# Altium schematic sheet MainRevA.SchDoc
size A2; SheetNumber: 1; SheetTotal: 1
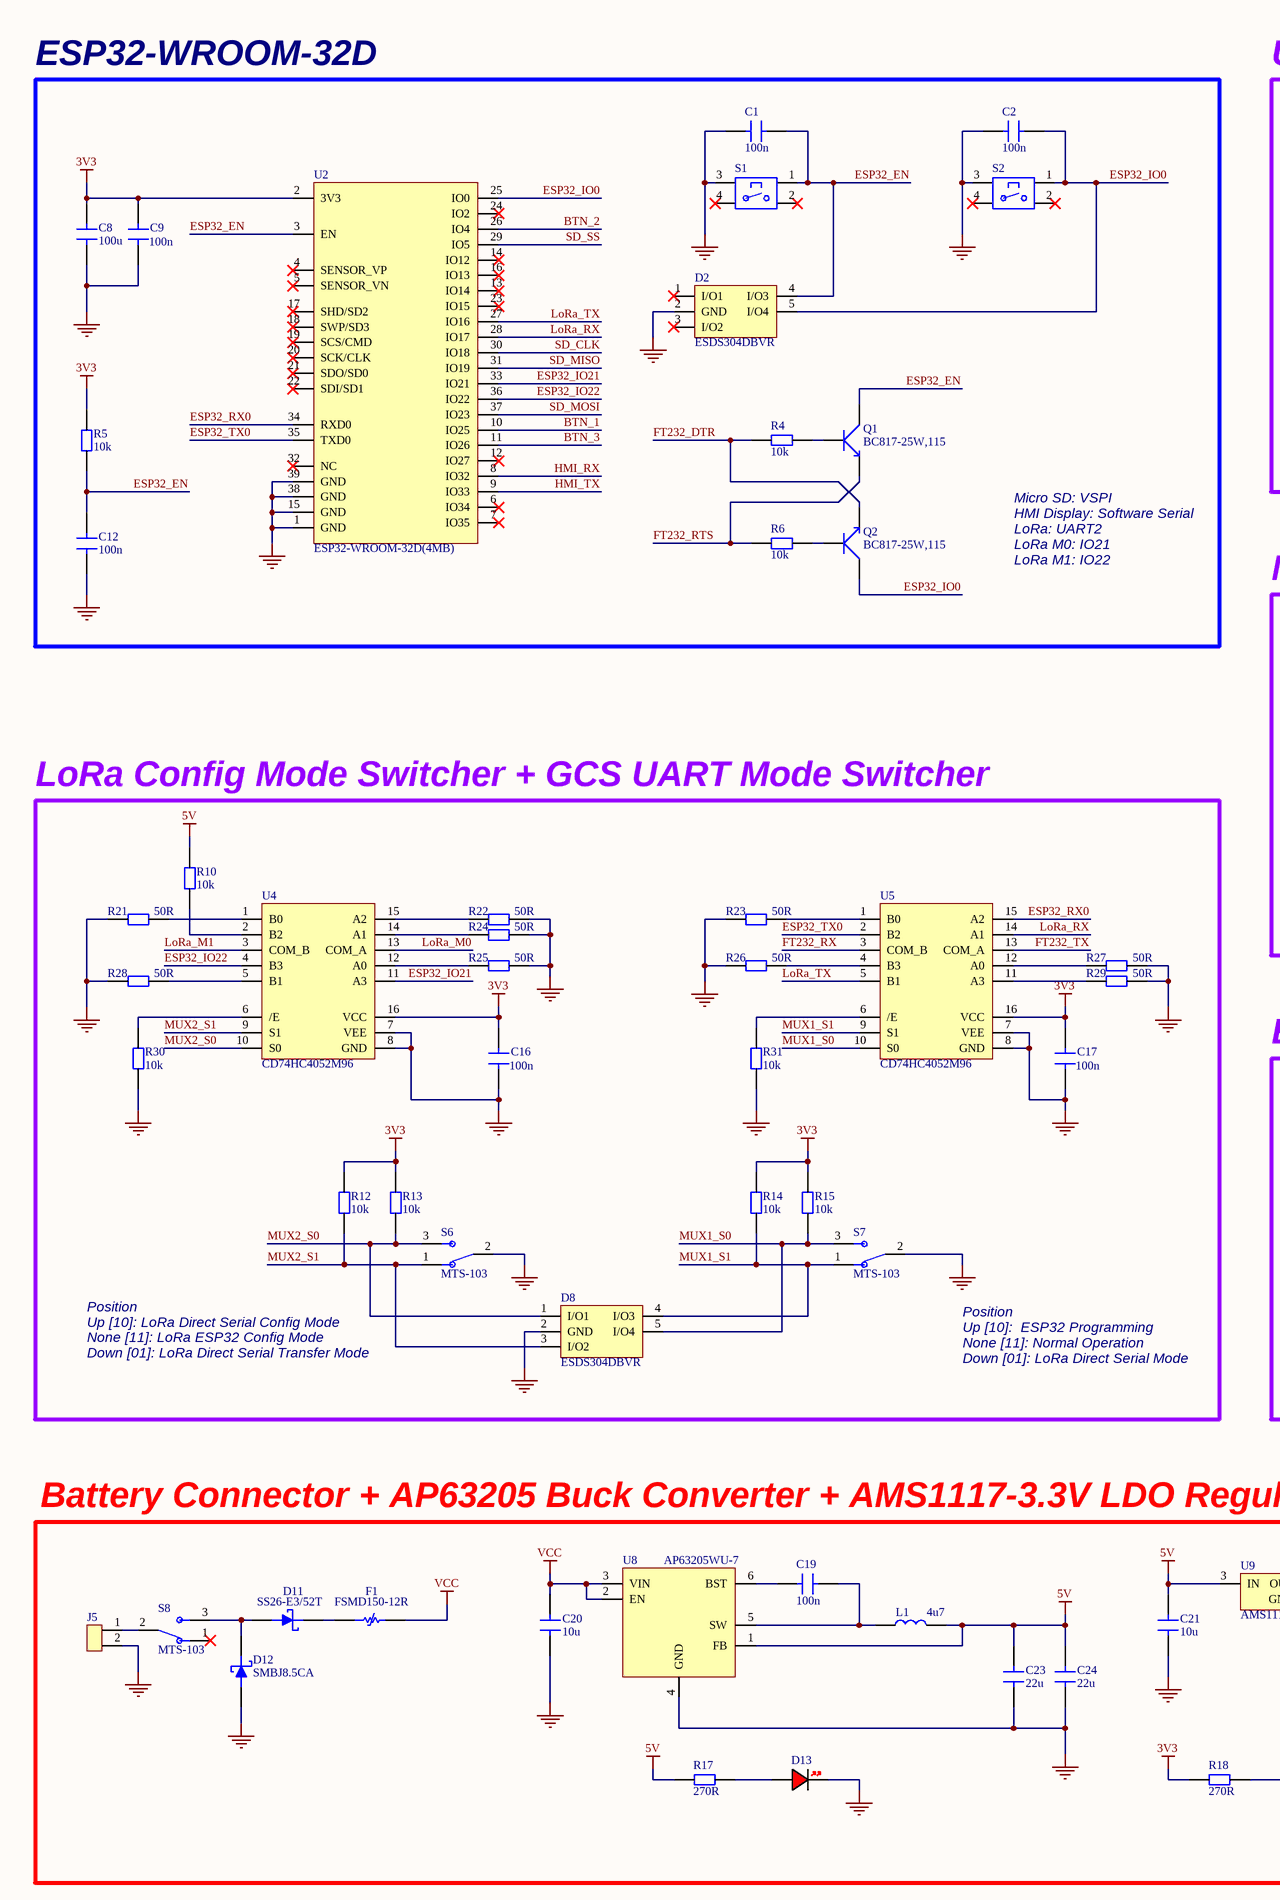
[diagram p0: MainRevA.SchDoc, left]
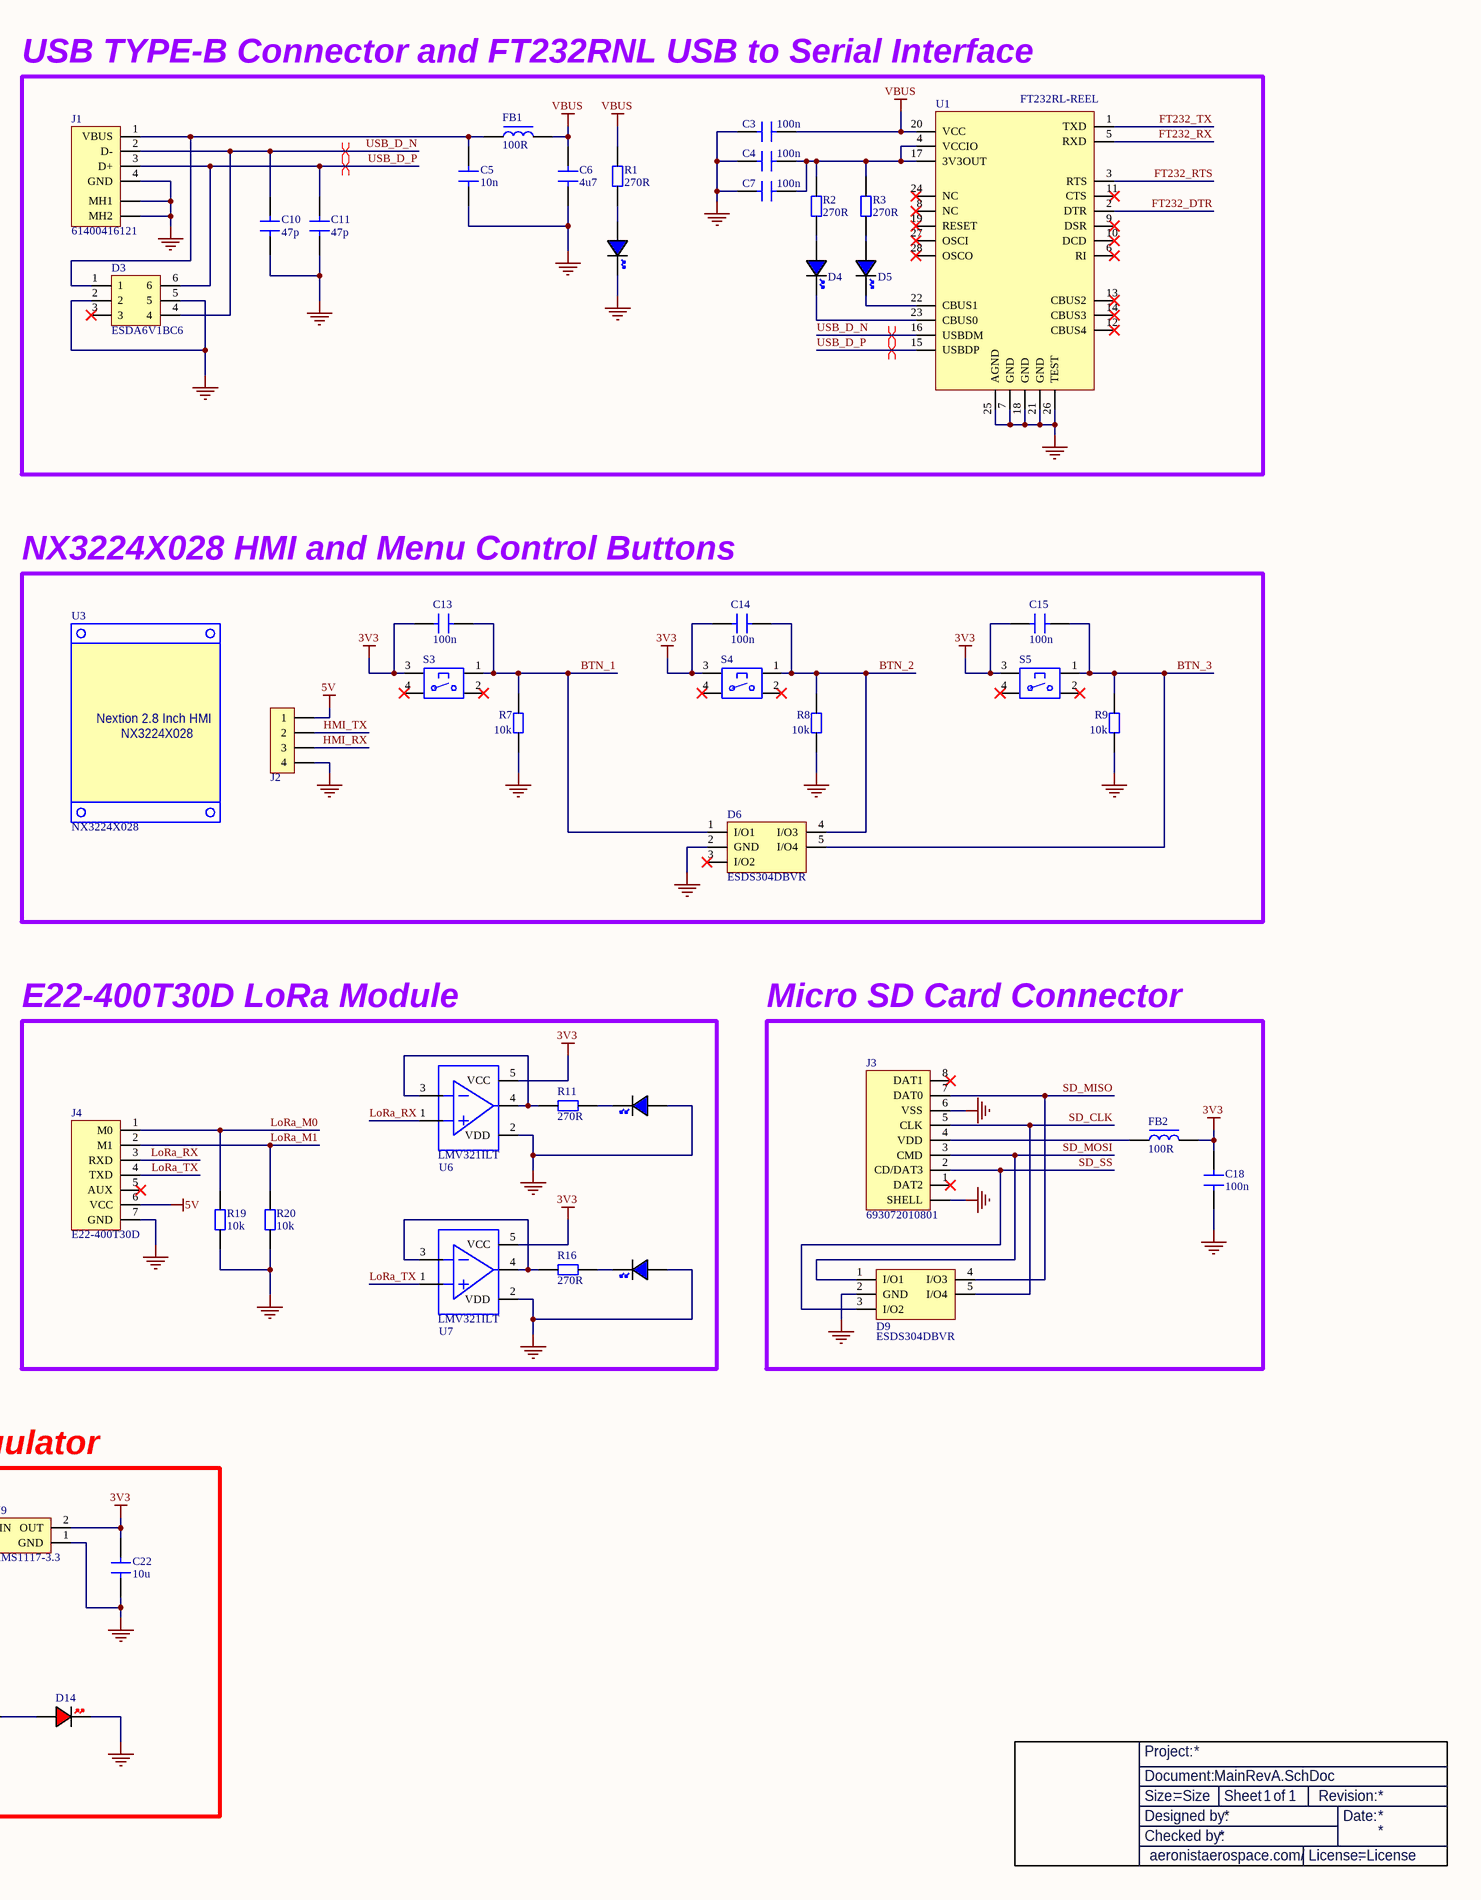
[diagram p1: MainRevA.SchDoc, right]

## Parts
?  Title Block  (value not drawn)  (graphical)
C1  100n  [CAP 0805]
C2  100n  [CAP 0805]
C3  100n  [CAP 0805]
C4  100n  [CAP 0805]
C5  10n  [CAP 0805]
C6  4u7  [CAP 0805]
C7  100n  [CAP 0805]
C8  100u  [CAP 1210]
C9  100n  [CAP 0805]
C10  47p  [CAP 0805]
C11  47p  [CAP 0805]
C12  100n  [CAP 0805]
C13  100n  [CAP 0805]
C14  100n  [CAP 0805]
C15  100n  [CAP 0805]
C16  100n  [CAP 0805]
C17  100n  [CAP 0805]
C18  100n  [CAP 0805]
C19  100n  [CAP 0805]
C20  10u  [CAP 1210]
C21  10u  [CAP 0805]
C22  10u  [CAP 0805]
C23  22u  [CAP 1210]
C24  22u  [CAP 1210]
D1  LED 0805 BLUE  [LED 0805 BLUE]  (value not drawn)
D2  ESDS304DBVR  [SOT-23-5]
D3  ESDA6V1BC6  [SOT-23-6]
D4  LED 0805 BLUE  [LED 0805 BLUE]  (value not drawn)
D5  LED 0805 BLUE  [LED 0805 BLUE]  (value not drawn)
D6  ESDS304DBVR  [SOT-23-5]
D7  LED 0805 BLUE  [LED 0805 BLUE]  (value not drawn)
D8  ESDS304DBVR  [SOT-23-5]
D9  ESDS304DBVR  [SOT-23-5]
D10  LED 0805 BLUE  [LED 0805 BLUE]  (value not drawn)
D11  SS26-E3/52T  [DO-214AA]
D12  SMBJ8.5CA  [SMBJ12CA-13-F]
D13  LED 0805 RED  [LED 0805 RED]  (value not drawn)
D14  LED 0805 RED  [LED 0805 RED]  (value not drawn)
F1  FSMD150-12R  [0ZCG0075FF2C]
FB1  100R  [FB 0805]
FB2  100R  [FB 0805]
J1  61400416121  [61400416121]
J2  1x4 HEADER MALE  [1X4 HEADER MALE]  (value not drawn)
J3  693072010801  [693072010801]
J4  E22-400T30D  [LoRa E22-433T30D H]
J5  KF350 2P Terminal  [KF350 2P]  (value not drawn)
L1  4u7  [IHLP2020CZER4R7M11]
Q1  BC817-25W,115  [BC817-25]
Q2  BC817-25W,115  [BC817-25]
R1  270R  [RES 0805]
R2  270R  [RES 0805]
R3  270R  [RES 0805]
R4  10k  [RES 0805]
R5  10k  [RES 0805]
R6  10k  [RES 0805]
R7  10k  [RES 0805]
R8  10k  [RES 0805]
R9  10k  [RES 0805]
R10  10k  [RES 0805]
R11  270R  [RES 0805]
R12  10k  [RES 0805]
R13  10k  [RES 0805]
R14  10k  [RES 0805]
R15  10k  [RES 0805]
R16  270R  [RES 0805]
R17  270R  [RES 0805]
R18  270R  [RES 0805]
R19  10k  [RES 0805]
R20  10k  [RES 0805]
R21  50R  [RES 0805]
R22  50R  [RES 0805]
R23  50R  [RES 0805]
R24  50R  [RES 0805]
R25  50R  [RES 0805]
R26  50R  [RES 0805]
R27  50R  [RES 0805]
R28  50R  [RES 0805]
R29  50R  [RES 0805]
R30  10k  [RES 0805]
R31  10k  [RES 0805]
S1  FSM4JSMATR  [FSM4JSMATR]  (value not drawn)
S2  FSM4JSMATR  [FSM4JSMATR]  (value not drawn)
S3  FSM4JSMATR  [FSM4JSMATR]  (value not drawn)
S4  FSM4JSMATR  [FSM4JSMATR]  (value not drawn)
S5  FSM4JSMATR  [FSM4JSMATR]  (value not drawn)
S6  MTS-103  [MTS-103]
S7  MTS-103  [MTS-103]
S8  MTS-103  [MTS-103]
U1  FT232RL-REEL  [FT232RL]
U2  ESP32-WROOM-32D(4MB)  [ESP32-WROOM-32]
U3  NX3224X028  [NX32224X028]
U4  CD74HC4052M96  [SOIC-16]
U5  CD74HC4052M96  [SOIC-16]
U6  LMV321ILT  [SOT-23-5]
U7  LMV321ILT  [SOT-23-5]
U8  AP63205WU-7  [AP63205]
U9  AMS1117-3.3  [SOT-223]

## Blocks framed on the sheet
ESP32-WROOM-32D: C1 C2 C8 C9 C12 D2 Q1 Q2 R4-R6 S1 S2 U2
USB TYPE-B Connector and FT232RNL USB to Serial Interface: C3-C7 C10 C11 D1 D3-D5 FB1 J1 R1-R3 U1
NX3224X028 HMI and Menu Control Buttons: C13-C15 D6 J2 R7-R9 S3-S5
LoRa Config Mode Switcher + GCS UART Mode Switcher: C16 C17 D8 R10 R12-R15 R21-R31 S6 S7 U4 U5
E22-400T30D LoRa Module: D7 D10 J4 R11 R16 R19 R20 U6 U7
Micro SD Card Connector: C18 D9 FB2 J3

## Nets
3V3: C8.2 C9.2 C13.2 C14.1 C15.2 C16.2 C17.2 C18.1 C22.1 FB2.2 R5.2 R12.2 R13.2 R14.2 R15.2 R18.1 S3.3 S4.3 S5.3 U2.2(3V3) U4.16(VCC) U5.16(VCC) U6.5(VCC) U7.5(VCC) U9.2(OUT)
5V: C21.1 C23.2 C24.2 J2.1 J4.6(VCC) L1.2 R10.2 R17.1 U8.1(FB) U9.3(IN)
GND: C1.2 C2.2 C3.2 C4.2 C5.1 C6.1 C7.2 C8.1 C9.1 C10.1 C11.1 C12.2 C16.1 C17.1 C18.2 C20.1 C21.2 C22.2 C23.1 C24.1 D1.K D2.2(GND) D3.2 D3.5 D6.2(GND) D7.A D8.2(GND) D9.2(GND) D10.A D12.1 D13.K D14.K J1.4(GND) J1.MH1 J1.MH2 J2.4 J3.6(VSS) J3.SHELL J4.7(GND) J5.2 R7.2 R8.2 R9.2 R19.1 R20.1 R21.2 R22.1 R23.2 R24.1 R25.1 R26.2 R27.1 R28.2 R29.1 R30.1 R31.1 S1.3 S2.3 S6.2 S7.2 U1.7(GND) U1.18(GND) U1.21(GND) U1.25(AGND) U1.26(TEST) U2.1(GND) U2.15(GND) U2.38(GND) U2.39(GND) U4.7(VEE) U4.8(GND) U5.7(VEE) U5.8(GND) U6.2(VDD) U7.2(VDD) U8.4(GND) U9.1(GND)
VBUS: C3.1 C6.2 FB1.2 R1.1 U1.20(VCC)
VCC: C20.2 F1.2 U8.2(EN) U8.3(VIN)
BTN_1: C13.1 D6.1(I/O1) R7.1 S3.1 U2.10(IO25)
BTN_2: C14.2 D6.4(I/O3) R8.1 S4.1 U2.26(IO4)
BTN_3: C15.1 D6.5(I/O4) R9.1 S5.1 U2.11(IO26)
ESP32_EN: C1.1 C12.1 D2.4(I/O3) Q1.3(C) R5.1 S1.1 U2.3(EN)
ESP32_IO0: C2.1 D2.5(I/O4) Q2.3(C) S2.1 U2.25(IO0)
ESP32_IO21: U2.33(IO21) U4.11(A3)
ESP32_IO22: U2.36(IO22) U4.4(B3)
ESP32_RX0: U2.34(RXD0) U5.15(A2)
ESP32_TX0: U2.35(TXD0) U5.2(B2)
FT232_DTR: Q2.2(E) R4.2 U1.2(DTR)
FT232_RTS: Q1.2(E) R6.2 U1.3(RTS)
FT232_RX: U1.5(RXD) U5.3(COM_B)
FT232_TX: U1.1(TXD) U5.13(COM_A)
HMI_RX: J2.3 U2.8(IO32)
HMI_TX: J2.2 U2.9(IO33)
LoRa_M0: J4.1(M0) R19.2 U4.13(COM_A)
LoRa_M1: J4.2(M1) R20.2 U4.3(COM_B)
LoRa_RX: J4.3(RXD) U2.28(IO17) U5.14(A1) U6.1(+)
LoRa_TX: J4.4(TXD) U2.27(IO16) U5.5(B1) U7.1(+)
MUX1_S0: D8.5(I/O4) R15.1 S7.3 U5.10(S0)
MUX1_S1: D8.4(I/O3) R14.1 S7.1 U5.9(S1)
MUX2_S0: D8.1(I/O1) R13.1 S6.3 U4.10(S0)
MUX2_S1: D8.3(I/O2) R12.1 S6.1 U4.9(S1)
SD_CLK: D9.5(I/O4) J3.5(CLK) U2.30(IO18)
SD_MISO: D9.4(I/O3) J3.7(DAT0) U2.31(IO19)
SD_MOSI: D9.1(I/O1) J3.3(CMD) U2.37(IO23)
SD_SS: D9.3(I/O2) J3.2(CD/DAT3) U2.29(IO5)
USB_D_N: C10.2 D3.4 J1.2(D-) U1.16(USBDM)
USB_D_P: C11.2 D3.6 J1.3(D+) U1.15(USBDP)
NetC4_1: C4.1 C7.1 R2.1 R3.1 U1.4(VCCIO) U1.17(3V3OUT)
NetC5_2: C5.2 D3.1 FB1.1 J1.1(VBUS)
NetC19_1: C19.1 L1.1 U8.5(SW)
NetC19_2: C19.2 U8.6(BST)
NetD1_A: D1.A R1.2
NetD4_A: D4.A R2.2
NetD4_K: D4.K U1.23(CBUS0)
NetD5_A: D5.A R3.2
NetD5_K: D5.K U1.22(CBUS1)
NetD7_K: D7.K R11.2
NetD10_K: D10.K R16.2
NetD11_1: D11.1 F1.1
NetD11_2: D11.2 D12.2 S8.3
NetD13_A: D13.A R17.2
NetD14_A: D14.A R18.2
NetFB2_1: FB2.1 J3.4(VDD)
NetJ5_1: J5.1 S8.2
NetQ1_1: Q1.1(B) R4.1
NetQ2_1: Q2.1(B) R6.1
NetR10_1: R10.1 U4.2(B2)
NetR11_1: R11.1 U6.3(-) U6.4(OUT)
NetR16_1: R16.1 U7.3(-) U7.4(OUT)
NetR21_1: R21.1 U4.1(B0)
NetR22_2: R22.2 U4.15(A2)
NetR23_1: R23.1 U5.1(B0)
NetR24_2: R24.2 U4.14(A1)
NetR25_2: R25.2 U4.12(A0)
NetR26_1: R26.1 U5.4(B3)
NetR27_2: R27.2 U5.12(A0)
NetR28_1: R28.1 U4.5(B1)
NetR29_2: R29.2 U5.11(A3)
NetR30_2: R30.2 U4.6(/E)
NetR31_2: R31.2 U5.6(/E)

Not connected (* = marked no-connect by the designer): D2 1(I/O1)* 3(I/O2)*; D3 3*; D6 3(I/O2)*; J3 1(DAT2)* 8(DAT1)*; J4 5(AUX)*; S1 2* 4*; S2 2* 4*; S3 2* 4*; S4 2* 4*; S5 2* 4*; S8 1*; U1 6(RI)* 8(NC)* 9(DSR)* 10(DCD)* 11(CTS)* 12(CBUS4)* 13(CBUS2)* 14(CBUS3)* 19(RESET)* 24(NC)* 27(OSCI)* 28(OSCO)*; U2 4(SENSOR_VP)* 5(SENSOR_VN)* 6(IO34)* 7(IO35)* 12(IO27)* 13(IO14)* 14(IO12)* 16(IO13)* 17(SHD/SD2)* 18(SWP/SD3)* 19(SCS/CMD)* 20(SCK/CLK)* 21(SDO/SD0)* 22(SDI/SD1)* 23(IO15)* 24(IO2)* 32(NC)*

## Layout directives
differential pair; differential pair class DIFF_USB: USB_D_N, USB_D_P

## Notes on the sheet
- Micro SD: VSPI
- HMI Display: Software Serial
- LoRa: UART2
- LoRa M0: IO21
- LoRa M1: IO22
- Position
- Up [10]: LoRa Direct Serial Config Mode
- None [11]: LoRa ESP32 Config Mode
- Down [01]: LoRa Direct Serial Transfer Mode
- Up [10]:  ESP32 Programming
- None [11]: Normal Operation
- Down [01]: LoRa Direct Serial Mode
- Battery Connector + AP63205 Buck Converter + AMS1117-3.3V LDO Regulator
- (in symbol NX3224X028) Nextion 2.8 Inch HMI
- (in symbol Title Block) Project:; Document:; Size:; Sheet; of; Revision:; Designed by:; Date:; Checked by:; aeronistaerospace.com/; License:

## Library data of the parts
C1-C7 C9-C19 C21 C22 = CAP 0805 50V: Capacitor SMD 0805 50V
C8 C23 C24 = CAP 1210 25V: Capacitor SMD 1210 25V
C20 = CAP 1210 50V: Capacitor SMD 1210 50V
D1 D4 D5 D7 D10 = LED 0805 BLUE: LED 0805 GREEN SMD
D2 D6 D8 D9 = ESDS304DBVR: Trans Voltage Suppressor Diode, 85W, 3.6V V(RWM), Unidirectional, 4 Element, Silicon; Manufacturer: Texas Instruments; Supplier: Mouser; Supplier Part Number: 595-ESDS304DBVR; Manufacturer Part Number: ESDS304DBVR; RoHS: Yes; Category: TVS Diodes; Stock: 132; Pricing: 1=0,45, 10=0,304, 50=0,304, 100=0,282, 1000=0,202, 10000=0,15 (USD); Terminal Finish: Tin; JESD-609 Code: e3; Diode Type: TRANS VOLTAGE SUPPRESSOR; Moisture Sensitivity Level: 1; Reach SVHC Compliant: Yes; RoHS Compliant: Yes; ComponentLink1URL: https://www.ti.com:443/lit/ds/symlink/esds302.pdf?src-supplier=IHS+Markit; ComponentLink1Description: https://www.ti.com:443/lit/ds/symlink/esds302.pdf?src-supplier=IHS+Markit; ComponentLink2URL: http://www.ti.com/lit/ds/symlink/esds302.pdf?src-supplier=Digikey; ComponentLink2Description: http://www.ti.com/lit/ds/symlink/esds302.pdf?src-supplier=Digikey
D3 = ESDA6V1BC6: Trans Voltage Suppressor Diode, 80W, 5V V(RWM), Bidirectional, 4 Element, Silicon; Manufacturer: STMicroelectronics; Package Body Material: Plastic; Max Breakdown Voltage: 8V; Min Breakdown Voltage: 6.1V; Number of Elements: 4; Time @ Peak Reflow Temperature-Max (s): 30s; Qualification Status: Not Qualified; Supplier: Arrow Electronics; Supplier Part Number: ESDA6V1BC6; Manufacturer Part Number: ESDA6V1BC6; RoHS: Yes; Category: TVS Diodes; Stock: 84000; Pricing: 3000=0,1532 (USD); Pins: 6; Diode Element Material: SILICON; Package Shape: Rectangular; Terminal Finish: Nickel; Max Operating Temperature: 150°C; JESD-609 Code: e4; Polarity: Bidirectional; Diode Type: TRANS VOLTAGE SUPPRESSOR; JESD-30 Code: R-PDSO-G6; Moisture Sensitivity Level: 1; Non-rep Peak Rev Power Dis-Max: 80W; Package Style: SMALL OUTLINEMeter; Peak Reflow Temperature (Cel): 260°C; Rep Pk Reverse Voltage-Max: 5V; Surface Mount: Yes; Technology: AVALANCHE; Terminal Form: Gull Wing; Terminal Position: DUAL; Reach SVHC Compliant: Yes; RoHS Compliant: Yes; ComponentLink1URL: https://datasheet.ciiva.com:443/pdfs/VipMasterIC/IC/SGST/SGSTS47549/SGSTS47549-1.pdf?src-supplier=IHS+Markit; ComponentLink1Description: https://datasheet.ciiva.com:443/pdfs/VipMasterIC/IC/SGST/SGSTS47549/SGSTS47549-1.pdf?src-supplier=IHS+Markit; ComponentLink2URL: https://datasheet.ciiva.com/14186/esda6v1bc6-st-eng-tds-14186554.pdf?src-supplier=Distrelec; ComponentLink2Description: https://datasheet.ciiva.com/14186/esda6v1bc6-st-eng-tds-14186554.pdf?src-supplier=Distrelec; ComponentLink3URL: https://datasheet.ciiva.com/4507/cd00001906-94538-4507893.pdf?src-supplier=Mouser; ComponentLink3Description: https://datasheet.ciiva.com/4507/cd00001906-94538-4507893.pdf?src-supplier=Mouser; ComponentLink4URL: https://datasheet.ciiva.com/15143/getdatasheetpartid-148472-15143793.pdf?src-supplier=Verical; ComponentLink4Description: https://datasheet.ciiva.com/15143/getdatasheetpartid-148472-15143793.pdf?src-supplier=Verical; ComponentLink5URL: https://datasheet.ciiva.com/7662/1671767-7662124.pdf?src-supplier=Element14; ComponentLink5Description: https://datasheet.ciiva.com/7662/1671767-7662124.pdf?src-supplier=Element14; ComponentLink6URL: https://datasheet.ciiva.com/338/cd00001906-338704.pdf?src-supplier=Digikey; ComponentLink6Description: https://datasheet.ciiva.com/338/cd00001906-338704.pdf?src-supplier=Digikey; ComponentLink7URL: https://datasheet.ciiva.com/338/cd00001906-338705.pdf?src-supplier=Digikey; ComponentLink7Description: https://datasheet.ciiva.com/338/cd00001906-338705.pdf?src-supplier=Digikey; ComponentLink8URL: https://datasheet.ciiva.com/11194/cd00001906-11194053.pdf?src-supplier=Avnet; ComponentLink8Description: https://datasheet.ciiva.com/11194/cd00001906-11194053.pdf?src-supplier=Avnet
D11 = SS26-E3/52T: Rectifier Diode, Schottky, 1 Phase, 1 Element, 2A, 60V V(RRM), Silicon, DO-214AA; Manufacturer: Vishay Semiconductors; Package Body Material: Plastic; Application(s): EFFICIENCY; Forward Voltage: 700mV; Non-rep Pk Forward Current-Max: 75A; Number of Elements: 1; Qualification Status: Not Qualified; Supplier: Arrow Electronics; Supplier Part Number: SS26-E3/52T; Manufacturer Part Number: SS26-E3/52T; RoHS: Yes; Category: Rectifier Diodes; Stock: 1482000; Pricing: 750=0,1023 (USD); Pins: 2; Diode Element Material: SILICON; Package Shape: Rectangular; Terminal Finish: Tin; Min Operating Temperature: -65°C; Max Operating Temperature: 150°C; JESD-609 Code: e3; Diode Type: RECTIFIER; JESD-30 Code: R-PDSO-C2; Moisture Sensitivity Level: 1; Number of Phases: 1; Max Output current: 2A; Package Style: SMALL OUTLINEMeter; Peak Reflow Temperature (Cel): 260°C; Rep Pk Reverse Voltage-Max: 60V; Surface Mount: Yes; Technology: SCHOTTKY; Terminal Form: C BEND; Terminal Position: DUAL; JEDEC-95 Code: DO-214AA; RoHS Compliant: Yes; Reach SVHC Compliant: No; ComponentLink1URL: https://datasheet.ciiva.com:443/pdfs/VipMasterIC/IC/VISH/VISH-S-A0003397022/VISH-S-A0003397022-1.pdf?src-supplier=IHS+Markit; ComponentLink1Description: https://datasheet.ciiva.com:443/pdfs/VipMasterIC/IC/VISH/VISH-S-A0003397022/VISH-S-A0003397022-1.pdf?src-supplier=IHS+Markit; ComponentLink2URL: http://www.farnell.com/datasheets/2243773.pdf?src-supplier=Farnell; ComponentLink2Description: http://www.farnell.com/datasheets/2243773.pdf?src-supplier=Farnell; ComponentLink3URL: http://www.mouser.com/ds/2/427/ss22-59686.pdf?src-supplier=Mouser; ComponentLink3Description: http://www.mouser.com/ds/2/427/ss22-59686.pdf?src-supplier=Mouser; ComponentLink4URL: http://components.arrow.com/part/dataview/42820119S9715575N5680?src-supplier=Arrow+Electronics; ComponentLink4Description: http://components.arrow.com/part/dataview/42820119S9715575N5680?src-supplier=Arrow+Electronics; ComponentLink5URL: https://www.alliedelec.com/m/d/a5cdc6a9796d04f8094106d10cac2262.pdf?src-supplier=Allied+Electronics; ComponentLink5Description: https://www.alliedelec.com/m/d/a5cdc6a9796d04f8094106d10cac2262.pdf?src-supplier=Allied+Electronics; ComponentLink6URL: http://www.produktinfo.conrad.com/datenblaetter/575000-599999/596527-da-01-en-DIODE_SCHOTTKY_SS26_E3_52T_DO_214AA_VIS.pdf?src-supplier=Conrad; ComponentLink6Description: http://www.produktinfo.conrad.com/datenblaetter/575000-599999/596527-da-01-en-DIODE_SCHOTTKY_SS26_E3_52T_DO_214AA_VIS.pdf?src-supplier=Conrad; ComponentLink7URL: http://www.vishay.com/docs/88748/88748.pdf?src-supplier=Future+Electronics; ComponentLink7Description: http://www.vishay.com/docs/88748/88748.pdf?src-supplier=Future+Electronics; ComponentLink8URL: https://datasheet.octopart.com/SS26-E3-52T-Vishay-datasheet-11549126.pdf?src-supplier=Newark; ComponentLink8Description: https://datasheet.octopart.com/SS26-E3-52T-Vishay-datasheet-11549126.pdf?src-supplier=Newark; ComponentLink9URL: https://datasheet.octopart.com/SS26-E3-52T-Vishay-datasheet-78862754.pdf?src-supplier=Element14; ComponentLink9Description: https://datasheet.octopart.com/SS26-E3-52T-Vishay-datasheet-78862754.pdf?src-supplier=Element14; ComponentLink10URL: http://www.farnell.com/datasheets/2243773.pdf?src-supplier=Newark; ComponentLink10Description: http://www.farnell.com/datasheets/2243773.pdf?src-supplier=Newark; ComponentLink11URL: https://datasheet.octopart.com/SS26-E3/52T-Vishay-datasheet-126433.pdf?src-supplier=Digikey; ComponentLink11Description: https://datasheet.octopart.com/SS26-E3/52T-Vishay-datasheet-126433.pdf?src-supplier=Digikey; ComponentLink12URL: http://www.vishay.com/docs/88748/88748.pdf?src-supplier=Avnet; ComponentLink12Description: http://www.vishay.com/docs/88748/88748.pdf?src-supplier=Avnet; ComponentLink13URL: http://www.vishay.com/docs/88748/ss22.pdf?src-supplier=Digikey; ComponentLink13Description: http://www.vishay.com/docs/88748/ss22.pdf?src-supplier=Digikey; ComponentLink14URL: http://docs-usa.electrocomponents.com/techlib:/itc_doclist_US.htm?stockno=7000962&src-supplier=Allied+Electronics; ComponentLink14Description: http://docs-usa.electrocomponents.com/techlib:/itc_doclist_US.htm?stockno=7000962&src-supplier=Allied+Electronics; ComponentLink15URL: https://datasheet.octopart.com/SS26-E3-52T-Vishay-datasheet-42673615.pdf?src-supplier=TME; ComponentLink15Description: https://datasheet.octopart.com/SS26-E3-52T-Vishay-datasheet-42673615.pdf?src-supplier=TME
D12 = SMBJ8.5CA: Diode TVS Single Bi-Dir 8.5V 600W 2-Pin SMB; Manufacturer: Bourns; Number of Bidirectional Channels: 1; Min Breakdown Voltage: 9.44V; Clamping Voltage: 137V; Power Line Protection: No; Breakdown Voltage: 10.8V; Polarity: Bidirectional; Peak Pulse Current: 41.7A; Diode Type: ZENER; Reverse Breakdown Voltage: 94.4V; Operating Supply Voltage: 3.5V; Max Surge Current: 100A; Max Reverse Leakage Current: 40uA; Test Current: 1mA; Leakage Current: 1uA; Supplier 1: Avnet; Manufacturer Part Number: SMBJ8.5CA; RoHS: Yes; Category: TVS Diodes; Pricing 1: 12000=0,0994, 18000=0,0973, 30000=0,0952, 60000=0,0931, 120000=0,091, 600000=0,0889, 1200000=0,0875 (USD); Mount: Surface Mount; Case/Package: DO-214AA; Number of Pins: 2; Min Operating Temperature: -55°C; Max Operating Temperature: 150°C; Packaging: Tape and Reel; Reverse Standoff Voltage: 8.5V; Peak Pulse Power: 600W; Series: SMBJ; Direction: Bidirectional; Number of Channels: 1; Number of Elements: 1; Max Breakdown Voltage: 10.8V; Max Power Dissipation: 600W; Termination: SMD/SMT; Radiation Hardening: No; Reach SVHC Compliant: No; RoHS Compliant: Yes; ComponentLink1URL: https://datasheet.ciiva.com/4510/smbj-51809-4510857.pdf?src-supplier=Mouser; ComponentLink1Description: https://datasheet.ciiva.com/4510/smbj-51809-4510857.pdf?src-supplier=Mouser; ComponentLink2URL: https://datasheet.ciiva.com/3022/smbj-3022665.pdf?src-supplier=Avnet; ComponentLink2Description: https://datasheet.ciiva.com/3022/smbj-3022665.pdf?src-supplier=Avnet; ComponentLink3URL: https://datasheet.ciiva.com/3022/smbj-3022666.pdf?src-supplier=Avnet; ComponentLink3Description: https://datasheet.ciiva.com/3022/smbj-3022666.pdf?src-supplier=Avnet; ComponentLink4URL: https://datasheet.ciiva.com/334/smbj-334791.pdf?src-supplier=Digikey; ComponentLink4Description: https://datasheet.ciiva.com/334/smbj-334791.pdf?src-supplier=Digikey; ComponentLink5URL: https://datasheet.ciiva.com/334/smbj-334792.pdf?src-supplier=Digikey; ComponentLink5Description: https://datasheet.ciiva.com/334/smbj-334792.pdf?src-supplier=Digikey; ComponentLink6URL: https://datasheet.ciiva.com/334/smbj-334790.pdf?src-supplier=Digikey; ComponentLink6Description: https://datasheet.ciiva.com/334/smbj-334790.pdf?src-supplier=Digikey; ComponentLink7URL: https://datasheet.ciiva.com/3022/smbj-3022670.pdf?src-supplier=Avnet; ComponentLink7Description: https://datasheet.ciiva.com/3022/smbj-3022670.pdf?src-supplier=Avnet; ComponentLink8URL: https://datasheet.ciiva.com/334/smbj-334764.pdf?src-supplier=Digikey; ComponentLink8Description: https://datasheet.ciiva.com/334/smbj-334764.pdf?src-supplier=Digikey; ComponentLink9URL: https://datasheet.ciiva.com/334/smbj-334765.pdf?src-supplier=Digikey; ComponentLink9Description: https://datasheet.ciiva.com/334/smbj-334765.pdf?src-supplier=Digikey; ComponentLink10URL: https://datasheet.ciiva.com/334/smbj-334763.pdf?src-supplier=Digikey; ComponentLink10Description: https://datasheet.ciiva.com/334/smbj-334763.pdf?src-supplier=Digikey
D13 D14 = LED 0805 RED: LED 0805 RED SMD
F1 = 0ZCG0150BF2C: PTC RESTTBLE 1.50A 24V CHIP 1812; Manufacturer: Bel; Current Rating: 100A; Supplier 1: Avnet; Manufacturer Part Number: 0ZCG0150BF2C; RoHS: Yes; Category: PTC Resettable Fuses; Stock 1: 20000; Pricing 1: 2000=0,10628, 4000=0,10217, 8000=0,09874, 12000=0,09531, 16000=0,09188, 20000=0,08846, 200000=0,06138 (USD); Voltage Rating: 24V; Height: 1.55mm; ComponentLink1URL: http://www.farnell.com/datasheets/2571640.pdf?src-supplier=Farnell; ComponentLink1Description: http://www.farnell.com/datasheets/2571640.pdf?src-supplier=Farnell; ComponentLink2URL: http://www.farnell.com/datasheets/2571640.pdf?src-supplier=Element14; ComponentLink2Description: http://www.farnell.com/datasheets/2571640.pdf?src-supplier=Element14; ComponentLink3URL: https://www.belfuse.com/resources/CircuitProtection/datasheets/0ZCG%20Nov2016.pdf?src-supplier=Digikey; ComponentLink3Description: https://www.belfuse.com/resources/CircuitProtection/datasheets/0ZCG%20Nov2016.pdf?src-supplier=Digikey; ComponentLink4URL: http://www.farnell.com/datasheets/2571640.pdf?src-supplier=Newark; ComponentLink4Description: http://www.farnell.com/datasheets/2571640.pdf?src-supplier=Newark; ComponentLink5URL: http://www.belfuse.com/pdfs/0ZCG.pdf?src-supplier=Avnet; ComponentLink5Description: http://www.belfuse.com/pdfs/0ZCG.pdf?src-supplier=Avnet; ComponentLink6URL: https://datasheet.octopart.com/0ZCG0150BF2C-Bel-Fuse-datasheet-138895723.pdf?src-supplier=Electro+Sonic; ComponentLink6Description: https://datasheet.octopart.com/0ZCG0150BF2C-Bel-Fuse-datasheet-138895723.pdf?src-supplier=Electro+Sonic
FB1 FB2 = FB 0805: Ferrite Bead SMD 0805
J1 = 61400416121: USB Connector, 4 Contact(s), Female, Right Angle, Solder Terminal, Locking, Receptacle; Manufacturer: Wurth Electronics; Connector Type: TELECOM AND DATACOM CONNECTOR; Option: General Purpose; Contact Resistance: 20mR; Durability: 1500Cycles; Empty Shell: No; Number Of Connectors: 1; Number Of PCB Rows: 2; PCB Contact Pattern: RECTANGULAR; Polarization Key: POLARIZED HOUSING; Number of Contacts: 4; Additional Feature: ROHS COMPLIANT; Board Mounting Option: SOLDERABLE RETENTION CLIPS; Dielectric Withstanding Voltage (AC): 750V; Insulation Resistance: 1GR; Rated Current (Signal): 1.5A; Body Depth: 0.65inch; Body Length: 0.472inch; Body Breadth: 0.421inch; PCB Contact Row Spacing: 2.0066mm; Reference Standard: UL; Reliability: COMMERCIAL; Supplier: Mouser; Supplier Part Number: 710-61400416121; Manufacturer Part Number: 61400416121; RoHS: Yes; Category: USB Connectors; Stock: 3231; Pricing: 1=1,41, 10=1,24, 50=1,17, 100=1,05, 1000=1,01, 10000=1,01 (USD); Mounting Technology: Board; Contact Finish - Mating: GOLD; Contact Finish - Termination: Gold (Au); Insulation Material: Polybutylene; Shell Finish: Nickel; Shell Material: Bronze; Contact Material: Copper Alloy; Min Operating Temperature: -40°C; Max Operating Temperature: 105°C; JESD-609 Code: e4; Body/Shell Style: RECEPTACLE; Contact Gender: Female; Contact Style: USB; Filter Feature: No; Mixed Contacts: No; Mounting Style: RIGHT ANGLE; Termination: Solder; Mating Information: NO; Mounting Option 1: LOCKING; Terminal Pitch: 2.4892mm; Terminal Length: 0.126inch; Flammability Rating: UL94 V-0; DIN Conformance: No; IEC Conformance: No; MIL Conformance: No; Reach SVHC Compliant: Yes; RoHS Compliant: Yes; ComponentLink1URL: https://datasheet.ciiva.com:443/pdfs/VipMasterIC/IC/MIDC/MIDC-S-A0004022663/MIDC-S-A0006489655-1.pdf?src-supplier=IHS+Markit; ComponentLink1Description: https://datasheet.ciiva.com:443/pdfs/VipMasterIC/IC/MIDC/MIDC-S-A0004022663/MIDC-S-A0006489655-1.pdf?src-supplier=IHS+Markit; ComponentLink2URL: https://datasheet.ciiva.com/1098/1697135-1098929.pdf?src-supplier=Element14; ComponentLink2Description: https://datasheet.ciiva.com/1098/1697135-1098929.pdf?src-supplier=Element14; ComponentLink3URL: https://datasheet.ciiva.com/1100/76589-1100560.pdf?src-supplier=Newark; ComponentLink3Description: https://datasheet.ciiva.com/1100/76589-1100560.pdf?src-supplier=Newark; ComponentLink4URL: https://datasheet.ciiva.com/4598/61400416121-69623-4598782.pdf?src-supplier=Mouser; ComponentLink4Description: https://datasheet.ciiva.com/4598/61400416121-69623-4598782.pdf?src-supplier=Mouser; ComponentLink5URL: https://datasheet.ciiva.com/851/61400416121-851771.pdf?src-supplier=Digikey; ComponentLink5Description: https://datasheet.ciiva.com/851/61400416121-851771.pdf?src-supplier=Digikey; ComponentLink6URL: https://datasheet.ciiva.com/11731/0900766b81023ab5-11731301.pdf?src-supplier=Rs; ComponentLink6Description: https://datasheet.ciiva.com/11731/0900766b81023ab5-11731301.pdf?src-supplier=Rs; ComponentLink7URL: https://datasheet.ciiva.com/14118/4257098-eng-datasheet-14118442.pdf?src-supplier=Distrelec; ComponentLink7Description: https://datasheet.ciiva.com/14118/4257098-eng-datasheet-14118442.pdf?src-supplier=Distrelec; ComponentLink8URL: https://datasheet.ciiva.com/48712/001088208-da-01-en-wr-com-usb-type-b-61400416121-48712662.pdf?src-supplier=Conrad; ComponentLink8Description: https://datasheet.ciiva.com/48712/001088208-da-01-en-wr-com-usb-type-b-61400416121-48712662.pdf?src-supplier=Conrad
J3 = 693072010801: PCB Connector, 8 Contact(s), 1 Row(s), Male, Right Angle, 0.043 inch Pitch, Surface Mount Terminal, Black Insulator, Receptacle; Manufacturer: Wurth Electronics; Board Mounting Option: SOLDER HOLDING POSTS; Contact Pattern: RECTANGULAR; Contact Resistance: 100mR; Dielectric Withstanding Voltage (AC): 500V; Durability: 10000Cycles; Insulation Resistance: 1GR; Number Of Connectors: 1; Rated Current (Signal): 500mA; Number of Contacts: 8; Body Breadth: 0.069inch; Body Depth: 0.539inch; Body Length: 0.535inch; Reference Standard: UL; Reliability: COMMERCIAL; Supplier: Mouser; Supplier Part Number: 710-693072010801; Manufacturer Part Number: 693072010801; RoHS: Yes; Category: Memory Connectors; Stock: 2877; Pricing: 1=3,48, 10=3,41, 50=3, 100=2,87, 1000=2,46, 10000=2,26 (USD); Mounting Technology: Board; Contact Finish - Mating: NOT SPECIFIED; Insulation Color: Black; Insulation Material: Polymer; Min Operating Temperature: -25°C; Max Operating Temperature: 85°C; Connector Type: PCB; Body/Shell Style: RECEPTACLE; Contact Gender: Male; Mounting Style: RIGHT ANGLE; Number Of PCB Rows: 1; Number of Ports: 1; Number of Rows Loaded: 1; PCB Contact Pattern: RECTANGULAR; Termination: SMD/SMT; Mating Contact Pitch: 0.043inch; Terminal Pitch: 1.0922mm; Reach SVHC Compliant: Yes; RoHS Compliant: Yes; ComponentLink1URL: https://datasheet.ciiva.com:443/pdfs/VipMasterIC/IC/MIDC/MIDC-S-A0000106158/MIDC-S-A0000106158-1.pdf?src-supplier=IHS+Markit; ComponentLink1Description: https://datasheet.ciiva.com:443/pdfs/VipMasterIC/IC/MIDC/MIDC-S-A0000106158/MIDC-S-A0000106158-1.pdf?src-supplier=IHS+Markit; ComponentLink2URL: https://datasheet.ciiva.com/1107/693072010801-1107219.pdf?src-supplier=Newark; ComponentLink2Description: https://datasheet.ciiva.com/1107/693072010801-1107219.pdf?src-supplier=Newark; ComponentLink3URL: https://datasheet.ciiva.com/25605/0900766b81113f29-25605360.pdf?src-supplier=Rs; ComponentLink3Description: https://datasheet.ciiva.com/25605/0900766b81113f29-25605360.pdf?src-supplier=Rs; ComponentLink4URL: https://datasheet.ciiva.com/1104/693072010801-1104797.pdf?src-supplier=Element14; ComponentLink4Description: https://datasheet.ciiva.com/1104/693072010801-1104797.pdf?src-supplier=Element14; ComponentLink5URL: https://datasheet.ciiva.com/6935/693072010801-6935071.pdf?src-supplier=Digikey; ComponentLink5Description: https://datasheet.ciiva.com/6935/693072010801-6935071.pdf?src-supplier=Digikey; ComponentLink6URL: https://datasheet.ciiva.com/6935/693072010801-6935068.pdf?src-supplier=Digikey; ComponentLink6Description: https://datasheet.ciiva.com/6935/693072010801-6935068.pdf?src-supplier=Digikey
J4 = E22-400T30D: SX1268 E22-400T30D LoRa Module Header
J5 = KF350 2P Terminal: 2 Pin Screw Terminal Block 3.5mm
L1 = IHLP2020CZER4R7M11: Inductor Power Shielded Wirewound 4.7uH 20% 100KHz Powdered Iron 4.5A 60mOhm DCR 2020 T/R; Manufacturer: Vishay; Supplier 1: Mouser; Manufacturer Part Number: IHLP2020CZER4R7M11; RoHS: No; Category: Fixed Inductors; Stock 1: 10031; Pricing 1: 1=1,19, 10=1,02, 50=1,02, 100=0,828, 1000=0,828, 10000=0,473 (USD); ComponentLink1URL: https://datasheet.ciiva.com/14803/lp20cz11-14803040.pdf?src-supplier=Arrow+Electronics; ComponentLink1Description: https://datasheet.ciiva.com/14803/lp20cz11-14803040.pdf?src-supplier=Arrow+Electronics; ComponentLink2URL: https://datasheet.ciiva.com/11798/0900766b8102c930-11798346.pdf?src-supplier=Rs; ComponentLink2Description: https://datasheet.ciiva.com/11798/0900766b8102c930-11798346.pdf?src-supplier=Rs; ComponentLink3URL: https://datasheet.ciiva.com/22694/480942-22694470.pdf?src-supplier=Element14; ComponentLink3Description: https://datasheet.ciiva.com/22694/480942-22694470.pdf?src-supplier=Element14; ComponentLink4URL: https://datasheet.ciiva.com/8017/480942-8017228.pdf?src-supplier=Element14; ComponentLink4Description: https://datasheet.ciiva.com/8017/480942-8017228.pdf?src-supplier=Element14; ComponentLink5URL: https://datasheet.ciiva.com/8494/lp20cz11-8494950.pdf?src-supplier=Avnet; ComponentLink5Description: https://datasheet.ciiva.com/8494/lp20cz11-8494950.pdf?src-supplier=Avnet; ComponentLink6URL: https://datasheet.ciiva.com/17112/70205433-17112327.pdf?src-supplier=Allied+Electronics; ComponentLink6Description: https://datasheet.ciiva.com/17112/70205433-17112327.pdf?src-supplier=Allied+Electronics; ComponentLink7URL: https://datasheet.ciiva.com/6688/lp20cz11-6688326.pdf?src-supplier=Digikey; ComponentLink7Description: https://datasheet.ciiva.com/6688/lp20cz11-6688326.pdf?src-supplier=Digikey; ComponentLink8URL: https://datasheet.ciiva.com/6688/lp20cz11-6688327.pdf?src-supplier=Digikey; ComponentLink8Description: https://datasheet.ciiva.com/6688/lp20cz11-6688327.pdf?src-supplier=Digikey; ComponentLink9URL: https://datasheet.ciiva.com/6688/lp20cz11-6688329.pdf?src-supplier=Digikey; ComponentLink9Description: https://datasheet.ciiva.com/6688/lp20cz11-6688329.pdf?src-supplier=Digikey
Q1 Q2 = BC817-25W,115: BC817 Series 45 V 500 mA NPN General Purpose Transistor - SOT-23; Manufacturer: Nexperia; Supplier 1: Future Electronics; Manufacturer Part Number: BC817-25W,115; RoHS: Yes; Category: BJTs; Stock 1: 99000; Pricing 1: 3000=0,0169, 12000=0,0162, 45000=0,0155, 90000=0,0152, 225000=0,0144 (USD); ComponentLink1URL: https://datasheet.octopart.com/BC817-25W%2C115-NXP-datasheet-29749.pdf?src-supplier=Future+Electronics; ComponentLink1Description: https://datasheet.octopart.com/BC817-25W%2C115-NXP-datasheet-29749.pdf?src-supplier=Future+Electronics; ComponentLink2URL: http://www.farnell.com/datasheets/699988.pdf?src-supplier=Newark; ComponentLink2Description: http://www.farnell.com/datasheets/699988.pdf?src-supplier=Newark; ComponentLink3URL: https://datasheet.octopart.com/BC817-25W%2C115-Nexperia-datasheet-155782301.pdf?src-supplier=TME; ComponentLink3Description: https://datasheet.octopart.com/BC817-25W%2C115-Nexperia-datasheet-155782301.pdf?src-supplier=TME; Supplier Part Number 1: 5067352
R1-R31 = RES 0805: Resistor SMD 0805
S1-S5 = FSM4JSMATR: Switch Tactile OFF (ON) SPST Round Button Gull Wing 0.05A 24VDC 1.57N SMD T/R; Manufacturer: TE Connectivity Alcoswitch; Supplier 1: Digi-Key; Manufacturer Part Number: FSM4JSMATR; RoHS: Yes; Category: Pushbutton Switches; Stock 1: 84996; Pricing 1: 1=0,36, 10=0,351, 25=0,33, 100=0,2866, 250=0,26, 500=0,24188 (USD); ComponentLink1URL: https://datasheet.ciiva.com/16320/eng-cs-1308111-1-switches-core-program-catalog-0308-16320065.pdf?src-supplier=Future+Electronics; ComponentLink1Description: https://datasheet.ciiva.com/16320/eng-cs-1308111-1-switches-core-program-catalog-0308-16320065.pdf?src-supplier=Future+Electronics; ComponentLink2URL: https://datasheet.ciiva.com/1530/1683375-1530944.pdf?src-supplier=Element14; ComponentLink2Description: https://datasheet.ciiva.com/1530/1683375-1530944.pdf?src-supplier=Element14; ComponentLink3URL: https://datasheet.ciiva.com/23765/1486934-23765878.pdf?src-supplier=Newark; ComponentLink3Description: https://datasheet.ciiva.com/23765/1486934-23765878.pdf?src-supplier=Newark; ComponentLink4URL: https://datasheet.ciiva.com/7638/921681-7638037.pdf?src-supplier=Element14; ComponentLink4Description: https://datasheet.ciiva.com/7638/921681-7638037.pdf?src-supplier=Element14
S6-S8 = MTS-103: Miniature Toggle Switch Single Pole Double Throw SPDT (MTS103) ON-OFF-ON 120VAC 5A 1/4 Inch Mounting
U1 = FT232RL-REEL: IC USB FS SERIAL UART 28-SSOP; Manufacturer: FTDI; Interface: UART,RS-232,RS-422,RS-485; Data Rate: 12Mbps; Number of Channels: 1; Max Supply Voltage: 5.25V; Min Supply Voltage: 3.3V; Operating Supply Current: 15mA; Voltage: 5V; Supplier 1: Arrow Electronics; Manufacturer Part Number: FT232RL-REEL; RoHS: Yes; Category: Interface ICs; Stock 1: 3812; Pricing 1: 1=4,75, 10=4,3, 50=4,1 (USD); Mount: Surface Mount; Case/Package: SSOP; Number of Pins: 28; Weight: 0.080001oz; Min Operating Temperature: -40°C; Max Operating Temperature: 85°C; Packaging: Tape and Reel; Series: USBmadeEZ-UART; Package Quantity: 1; Number of Transceivers: 1; Length: 10.2mm; Width: 5.3mm; Height: 1.75mm; Radiation Hardening: No; Lead Free: Lead Free; RoHS Compliant: Yes; Reach SVHC Compliant: No; ComponentLink1URL: https://datasheet.ciiva.com/34304/2161019-34304054.pdf?src-supplier=Jameco; ComponentLink1Description: https://datasheet.ciiva.com/34304/2161019-34304054.pdf?src-supplier=Jameco; ComponentLink2URL: https://datasheet.ciiva.com/4787/ds-ft232r-11534-4787658.pdf?src-supplier=Mouser; ComponentLink2Description: https://datasheet.ciiva.com/4787/ds-ft232r-11534-4787658.pdf?src-supplier=Mouser; ComponentLink3URL: https://datasheet.ciiva.com/1787/ds-ft232r-1787048.pdf?src-supplier=Digikey; ComponentLink3Description: https://datasheet.ciiva.com/1787/ds-ft232r-1787048.pdf?src-supplier=Digikey; ComponentLink4URL: https://datasheet.ciiva.com/1787/ds-ft232r-1787047.pdf?src-supplier=Digikey; ComponentLink4Description: https://datasheet.ciiva.com/1787/ds-ft232r-1787047.pdf?src-supplier=Digikey; ComponentLink5URL: https://datasheet.ciiva.com/1787/ds-ft232r-1787049.pdf?src-supplier=Digikey; ComponentLink5Description: https://datasheet.ciiva.com/1787/ds-ft232r-1787049.pdf?src-supplier=Digikey; ComponentLink6URL: https://datasheet.ciiva.com/16200/ds-ft232r-16200652.pdf?src-supplier=Future+Electronics; ComponentLink6Description: https://datasheet.ciiva.com/16200/ds-ft232r-16200652.pdf?src-supplier=Future+Electronics; ComponentLink7URL: https://datasheet.ciiva.com/15150/getdatasheetpartid-643207-15150506.pdf?src-supplier=Verical; ComponentLink7Description: https://datasheet.ciiva.com/15150/getdatasheetpartid-643207-15150506.pdf?src-supplier=Verical
U2 = ESP32-WROOM-32D(4MB): Rx Txrx Mod Wifi Trace Ant SMD; Manufacturer: Espressif Systems; Supplier: Mouser; Supplier Part Number: 356-ESP32WROOM32D4MB; Manufacturer Part Number: ESP32-WROOM-32D(4MB); RoHS: No; Category: LDO
U4 U5 = CD74HC4052M96: Differential Multiplexer, 1 Func, 2 Channel, CMOS, PDSO16; Manufacturer: Texas Instruments; Package Body Material: Plastic; Neg Supply Voltage-Max (Vsup): -6V; Neg Supply Voltage-Min (Vsup): 0V; Neg Supply Voltage-Nom (Vsup): -4.5V; Number of Channels: 4; Channels: 1; Off-state Isolation-Nom: 65dB; On-state Resistance Match-Nom: 5R; On-state Resistance-Max (Ron): 130R; Package Equivalence Code: SOP16,.25; Power Supplies: 2/6,GND/-6V; Signal Current-Max: 25mA; Supply Current-Max (Isup): 320uA; Max Supply Voltage: 6V; Min Supply Voltage: 2V; Nominal Supply Voltage: 4.5V; Switch-off Time-Max: 38ns; Switch-on Time-Max: 46ns; Switching: BREAK-BEFORE-MAKEV; Qualification Status: Not Qualified; Supplier: Mouser; Supplier Part Number: 595-CD74HC4052M96; Manufacturer Part Number: CD74HC4052M96; RoHS: Yes; Category: Decoders and Multiplexers; Stock: 4443; Pricing: 1=0,35, 10=0,239, 50=0,212, 100=0,183, 1000=0,154, 10000=0,135 (USD); Case/Package: SOP; Pins: 16; Package Shape: Rectangular; Terminal Finish: Tin; Min Operating Temperature: -55°C; Max Operating Temperature: 125°C; Throw Configuration: DIFFERENTIAL MULTIPLEXER; JESD-30 Code: R-PDSO-G16; Package Style: SMALL OUTLINEMeter; Surface Mount: Yes; Technology: CMOS; Terminal Form: Gull Wing; Terminal Position: DUAL; JESD-609 Code: e3; Moisture Sensitivity Level: 1; Peak Reflow Temperature (Cel): 260°C; Length: 9.9mm; Width: 3.9mm; Height - Seated (Max): 1.75mm; Terminal Pitch: 1.27mm; Temperature Grade: MILITARY; Reach SVHC Compliant: Yes; RoHS Compliant: Yes; ComponentLink1URL: https://www.ti.com:443/lit/ds/symlink/cd54hc4051.pdf?src-supplier=IHS+Markit; ComponentLink1Description: https://www.ti.com:443/lit/ds/symlink/cd54hc4051.pdf?src-supplier=IHS+Markit; ComponentLink2URL: https://datasheet.ciiva.com/27052/1326627-27052007.pdf?src-supplier=Jameco; ComponentLink2Description: https://datasheet.ciiva.com/27052/1326627-27052007.pdf?src-supplier=Jameco; ComponentLink3URL: https://datasheet.ciiva.com/15127/getdatasheetpartid-296378-15127634.pdf?src-supplier=Verical; ComponentLink3Description: https://datasheet.ciiva.com/15127/getdatasheetpartid-296378-15127634.pdf?src-supplier=Verical; ComponentLink4URL: https://datasheet.ciiva.com/1669/cd74hc4051-1669664.pdf?src-supplier=Digikey; ComponentLink4Description: https://datasheet.ciiva.com/1669/cd74hc4051-1669664.pdf?src-supplier=Digikey; ComponentLink5URL: https://datasheet.ciiva.com/45291/cd74hct4053-45291341.pdf?src-supplier=Avnet; ComponentLink5Description: https://datasheet.ciiva.com/45291/cd74hct4053-45291341.pdf?src-supplier=Avnet; ComponentLink6URL: https://datasheet.ciiva.com/1669/cd74hc4051-1669663.pdf?src-supplier=Digikey; ComponentLink6Description: https://datasheet.ciiva.com/1669/cd74hc4051-1669663.pdf?src-supplier=Digikey; ComponentLink7URL: https://datasheet.ciiva.com/1669/cd74hc4051-1669662.pdf?src-supplier=Digikey; ComponentLink7Description: https://datasheet.ciiva.com/1669/cd74hc4051-1669662.pdf?src-supplier=Digikey; ComponentLink8URL: https://datasheet.ciiva.com/48707/001047747-da-01-en-ic-de-mux-dl-4-cd74hc4052m96-soic-16-tid-48707579.pdf?src-supplier=Conrad; ComponentLink8Description: https://datasheet.ciiva.com/48707/001047747-da-01-en-ic-de-mux-dl-4-cd74hc4052m96-soic-16-tid-48707579.pdf?src-supplier=Conrad
U6 U7 = LMV321ILT: Operational Amplifier, 1 Func, 6000uV Offset-Max, BICMOS, PDSO5; Manufacturer: STMicroelectronics; Package Body Material: Plastic; Architecture: VOLTAGE-FEEDBACK; Average Bias Current-Max (IIB): 95nA; Bias Current-Max (IIB) @25C: 63nA; Common-mode Reject Ratio-Nom: 95dB; Frequency Compensation: YES; Input Offset Voltage-Max: 6mV; Low-Bias: No; Channels: 1; Package Equivalence Code: TSOP5/6,.11,37; Power Supplies: 2.7/5V; Slew Rate: 0.45V/µs; Max Supply Current: 250uA; Supply Voltage Limit-Max: 7V; Nominal Supply Voltage: 5V; Time @ Peak Reflow Temperature-Max (s): 30s; Unity Gain BW-Nom: 1.3MHz; Voltage Gain-Min: 3160; Qualification Status: Not Qualified; Supplier: Arrow Electronics; Supplier Part Number: LMV321ILT; Manufacturer Part Number: LMV321ILT; RoHS: Yes; Category: Amplifiers - Op Amps, Buffer, Instrumentation; Stock: 1011000; Pricing: 3000=0,2218, 6000=0,2146, 9000=0,1644 (USD); Case/Package: LSSOP; Pins: 5; Package Shape: Rectangular; Terminal Finish: Tin; Min Operating Temperature: -40°C; Max Operating Temperature: 125°C; JESD-30 Code: R-PDSO-G5; Package Style: SMALL OUTLINE, LOW PROFILE, SHRINK PITCHMeter; Surface Mount: Yes; Terminal Form: Gull Wing; Terminal Position: DUAL; JESD-609 Code: e3; Amplifier Type: OPERATIONAL AMPLIFIER; Low-Offset: No; Micropower: Yes; Moisture Sensitivity Level: 1; Packaging: Tape and Reel; Peak Reflow Temperature (Cel): 260°C; Power: No; Programmable Power: No; Technology: BICMOS; Wideband: No; Length: 2.9mm; Width: 1.625mm; Height - Seated (Max): 1.45mm; Terminal Pitch: 0.95mm; Reach SVHC Compliant: Yes; RoHS Compliant: Yes; Temperature Grade: AUTOMOTIVE; ComponentLink1URL: https://datasheet.ciiva.com:443/pdfs/VipMasterIC/IC/SGST/SGST-S-A0009735974/SGST-S-A0009735974-1.pdf?src-supplier=IHS+Markit; ComponentLink1Description: https://datasheet.ciiva.com:443/pdfs/VipMasterIC/IC/SGST/SGST-S-A0009735974/SGST-S-A0009735974-1.pdf?src-supplier=IHS+Markit; ComponentLink2URL: https://datasheet.ciiva.com/8008/1733540-8008505.pdf?src-supplier=Element14; ComponentLink2Description: https://datasheet.ciiva.com/8008/1733540-8008505.pdf?src-supplier=Element14; ComponentLink3URL: https://datasheet.ciiva.com/8008/1733540-8008506.pdf?src-supplier=Element14; ComponentLink3Description: https://datasheet.ciiva.com/8008/1733540-8008506.pdf?src-supplier=Element14; ComponentLink4URL: https://datasheet.ciiva.com/16449/cd00079372-16449002.pdf?src-supplier=Future+Electronics; ComponentLink4Description: https://datasheet.ciiva.com/16449/cd00079372-16449002.pdf?src-supplier=Future+Electronics; ComponentLink5URL: https://datasheet.ciiva.com/11710/cd00079372-11710214.pdf?src-supplier=Avnet; ComponentLink5Description: https://datasheet.ciiva.com/11710/cd00079372-11710214.pdf?src-supplier=Avnet; ComponentLink6URL: https://datasheet.ciiva.com/1795/cd00079372-1795891.pdf?src-supplier=Digikey; ComponentLink6Description: https://datasheet.ciiva.com/1795/cd00079372-1795891.pdf?src-supplier=Digikey; ComponentLink7URL: https://datasheet.ciiva.com/1795/cd00079372-1795892.pdf?src-supplier=Digikey; ComponentLink7Description: https://datasheet.ciiva.com/1795/cd00079372-1795892.pdf?src-supplier=Digikey; ComponentLink8URL: https://datasheet.ciiva.com/1795/cd00079372-1795893.pdf?src-supplier=Digikey; ComponentLink8Description: https://datasheet.ciiva.com/1795/cd00079372-1795893.pdf?src-supplier=Digikey
U8 = AP63205WU-7: AP63205 Series 32 V 2 A 1.1 MHz Synchronous Buck Converter -TSOT-26; Manufacturer: Diodes; Max Duty Cycle: 100%; Max Supply Voltage: 32V; Min Supply Voltage: 3.8V; Nominal Supply Current: 22uA; Number of Outputs: 1NUMBER; Output Current: 2A; Output Voltage: 5V; Switching Frequency: 1.1MHz; Supplier 1: Future Electronics; Manufacturer Part Number: AP63205WU-7; RoHS: Yes; Category: Voltage Regulators - Switching; Stock 1: 45000; Pricing 1: 3000=0,33, 6000=0,32 (USD); Min Operating Temperature: -40°C; Max Operating Temperature: 85°C; Height: 1mm; ComponentLink1URL: https://www.diodes.com/assets/Datasheets/AP63200-AP63201-AP63203-AP63205.pdf?src-supplier=Digikey; ComponentLink1Description: https://www.diodes.com/assets/Datasheets/AP63200-AP63201-AP63203-AP63205.pdf?src-supplier=Digikey
U9 = AMS1117-3.3: Linear Voltage Regulator IC Positive Fixed 1 Output 1A